# Altium schematic sheet heet1.SchDoc
size B; Date: 4/19/2001; CheckedBy: RD; CompanyName: DUNN, INC.; DrawnBy: Robert Dunn; Engineer: Robert Dunn; SheetNumber: 1; SheetTotal: 1; PageSetup: Record=PageOptions|SelectedOnly=False|CenterHorizontal=True|CenterVertical=True|PrintScale=0.74|XCorrection=1.00|YCorrection=1.00|PrintKind=1|BorderSize=5000000|LeftOffset=0|BottomOffset=0|Orientation=2|PaperLength=2970|PaperWidth=2100|Scale=100|PaperSource=7|PrintQuality=1200|MediaType=1|DitherType=10|PaperKind=A4 (210 x 297 mm)|PrintScaleMode=1
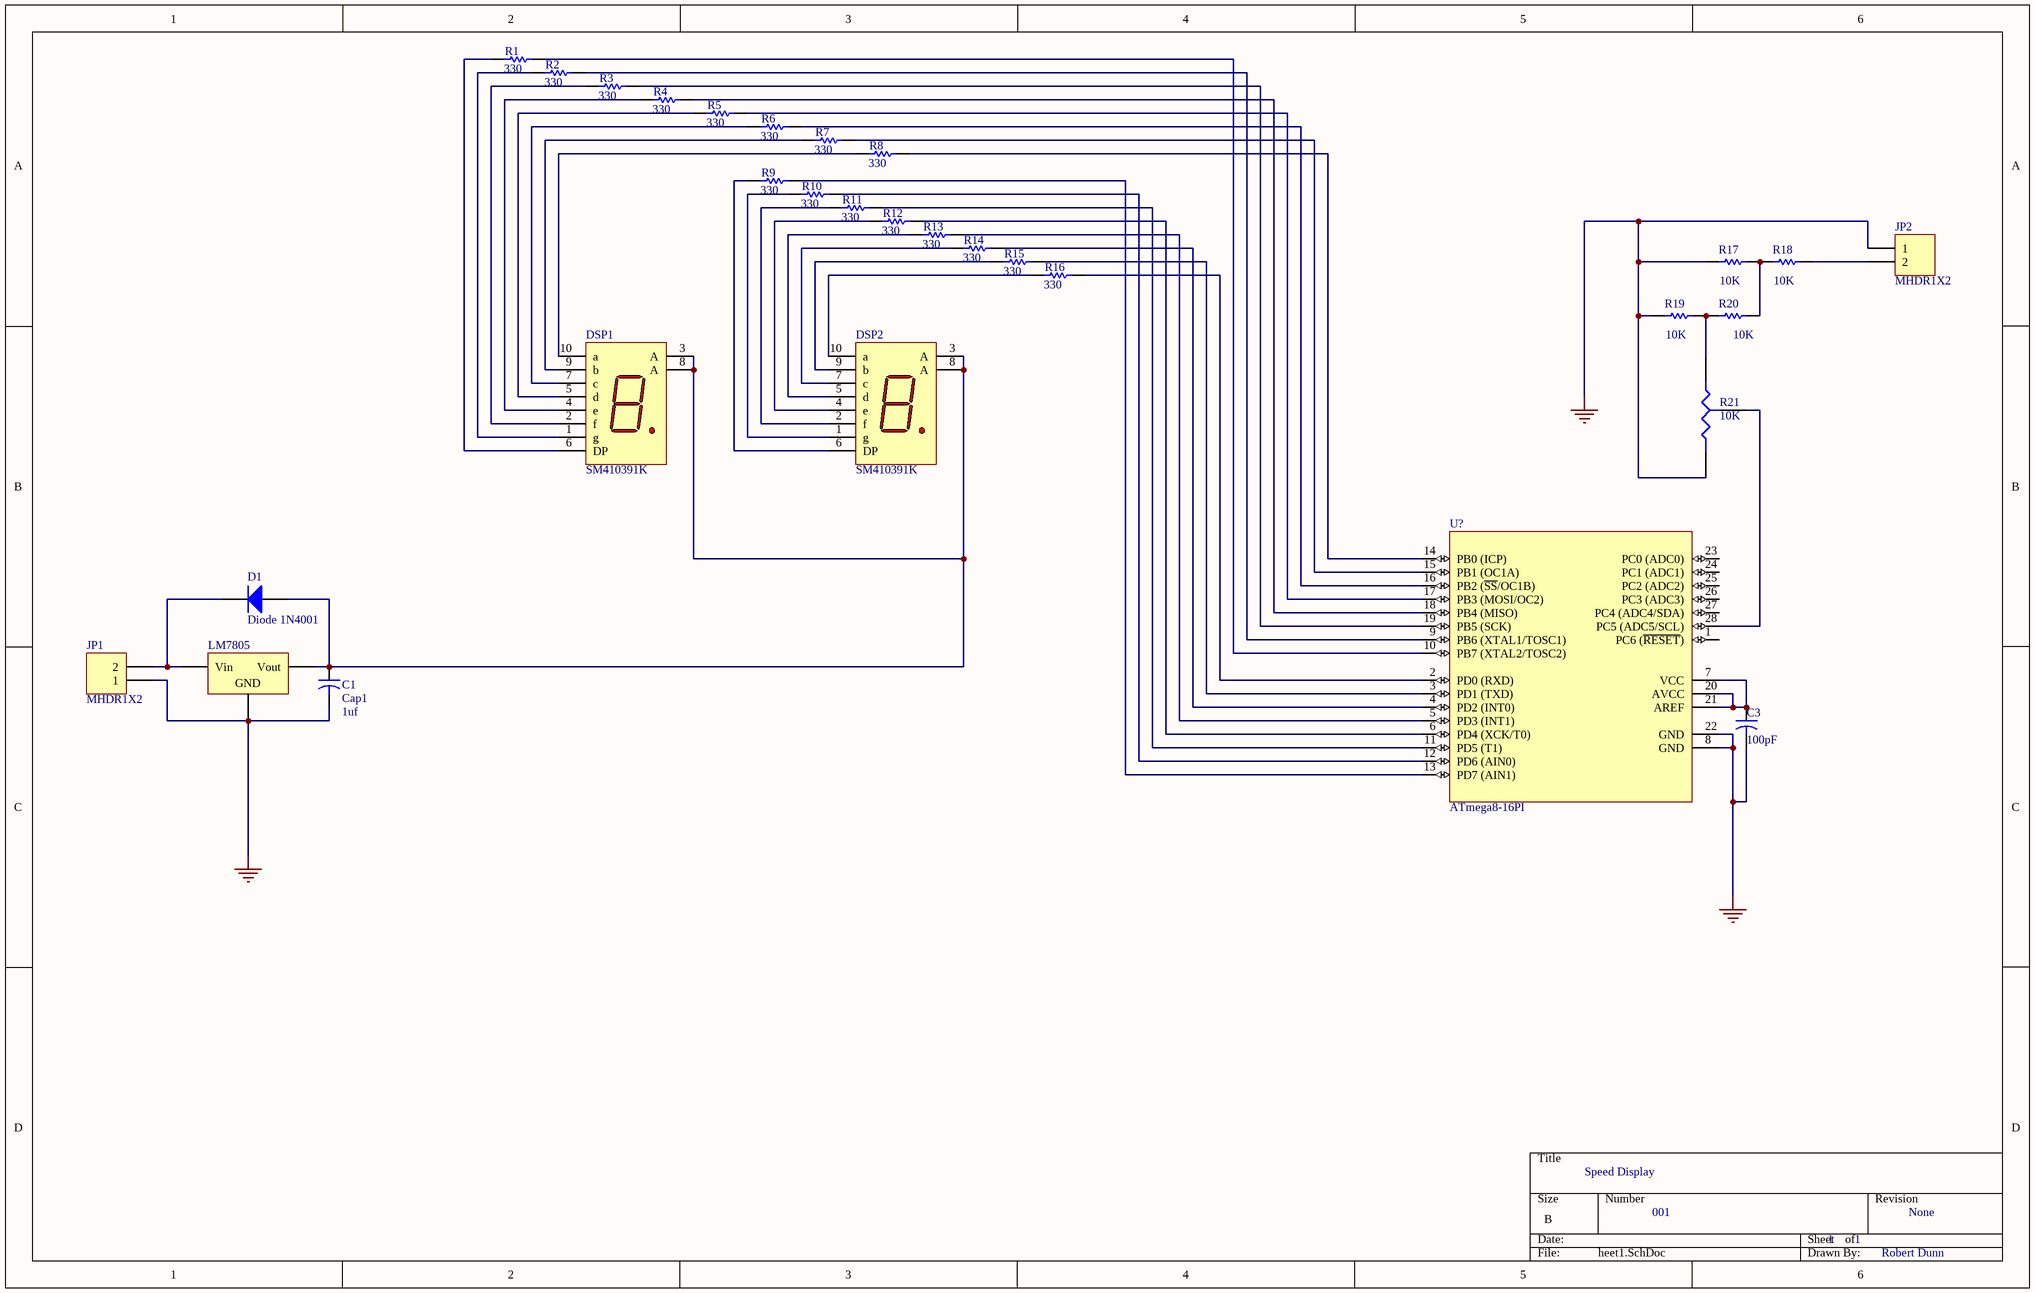
[diagram p0: heet1.SchDoc]

## Parts
C1  Cap1  value 1uf  [CAPR5-4X5]
C3  value 100pF  [CAPR5-4X5]  (hidden comment: Cap2)
D1  Diode 1N4001  [DIO10.46-5.3x2.8]
DSP1  SM410391K  [LEDDIP-10/C5.08]
DSP2  SM410391K  [LEDDIP-10/C5.08]
JP1  MHDR1X2  [MHDR1X2]
JP2  MHDR1X2  [MHDR1X2]
LM7805  (no value)  [SIP-G3/Y2]
R1  value 330  [AXIAL-0.3]  (hidden comment: Res1)
R2  value 330  [AXIAL-0.3]  (hidden comment: Res1)
R3  value 330  [AXIAL-0.3]  (hidden comment: Res1)
R4  value 330  [AXIAL-0.3]  (hidden comment: Res1)
R5  value 330  [AXIAL-0.3]  (hidden comment: Res1)
R6  value 330  [AXIAL-0.3]  (hidden comment: Res1)
R7  value 330  [AXIAL-0.3]  (hidden comment: Res1)
R8  value 330  [AXIAL-0.3]  (hidden comment: Res1)
R9  value 330  [AXIAL-0.3]  (hidden comment: Res1)
R10  value 330  [AXIAL-0.3]  (hidden comment: Res1)
R11  value 330  [AXIAL-0.3]  (hidden comment: Res1)
R12  value 330  [AXIAL-0.3]  (hidden comment: Res1)
R13  value 330  [AXIAL-0.3]  (hidden comment: Res1)
R14  value 330  [AXIAL-0.3]  (hidden comment: Res1)
R15  value 330  [AXIAL-0.3]  (hidden comment: Res1)
R16  value 330  [AXIAL-0.3]  (hidden comment: Res1)
R17  value 10K  [AXIAL-0.3]
R18  value 10K  [AXIAL-0.3]
R19  value 10K  [AXIAL-0.3]
R20  value 10K  [AXIAL-0.3]
R21  value 10K  [VR3]
U?  ATmega8-16PI  [28P3]

## Nets
GND: C1.2 C3.2 JP1.1 JP2.1 LM7805.2(GND) R17.1 R19.1 R21.2(B) U?.8(GND) U?.22(GND)
NetC1_1: C1.1 D1.1(A) DSP1.3(A) DSP1.8(A) DSP2.3(A) DSP2.8(A) LM7805.3(Vout)
NetC3_1: C3.1 U?.7(VCC) U?.20(AVCC) U?.21(AREF)
NetD1_2: D1.2(K) JP1.2 LM7805.1(Vin)
NetDSP1_1: DSP1.1(g) R2.1
NetDSP1_2: DSP1.2(f) R3.1
NetDSP1_4: DSP1.4(e) R4.1
NetDSP1_5: DSP1.5(d) R5.1
NetDSP1_6: DSP1.6(DP) R1.1
NetDSP1_7: DSP1.7(c) R6.1
NetDSP1_9: DSP1.9(b) R7.1
NetDSP1_10: DSP1.10(a) R8.1
NetDSP2_1: DSP2.1(g) R10.1
NetDSP2_2: DSP2.2(f) R11.1
NetDSP2_4: DSP2.4(e) R12.1
NetDSP2_5: DSP2.5(d) R13.1
NetDSP2_6: DSP2.6(DP) R9.1
NetDSP2_7: DSP2.7(c) R14.1
NetDSP2_9: DSP2.9(b) R15.1
NetDSP2_10: DSP2.10(a) R16.1
NetJP2_2: JP2.2 R18.2
NetR1_2: R1.2 U?.10(PB7_(XTAL2/TOSC2))
NetR2_2: R2.2 U?.9(PB6_(XTAL1/TOSC1))
NetR3_2: R3.2 U?.19(PB5_(SCK))
NetR4_2: R4.2 U?.18(PB4_(MISO))
NetR5_2: R5.2 U?.17(PB3_(MOSI/OC2))
NetR6_2: R6.2 U?.16(PB2_(~{SS}/OC1B))
NetR7_2: R7.2 U?.15(PB1_(OC1A))
NetR8_2: R8.2 U?.14(PB0_(ICP))
NetR9_2: R9.2 U?.13(PD7_(AIN1))
NetR10_2: R10.2 U?.12(PD6_(AIN0))
NetR11_2: R11.2 U?.11(PD5_(T1))
NetR12_2: R12.2 U?.6(PD4_(XCK/T0))
NetR13_2: R13.2 U?.5(PD3_(INT1))
NetR14_2: R14.2 U?.4(PD2_(INT0))
NetR15_2: R15.2 U?.3(PD1_(TXD))
NetR16_2: R16.2 U?.2(PD0_(RXD))
NetR17_2: R17.2 R18.1 R20.2
NetR19_2: R19.2 R20.1 R21.1(A)
NetR21_3: R21.3(TAP) U?.28(PC5_(ADC5/SCL))

Not connected (* = marked no-connect by the designer): U? 1(PC6_(~{RESET})) 23(PC0_(ADC0)) 24(PC1_(ADC1)) 25(PC2_(ADC2)) 26(PC3_(ADC3)) 27(PC4_(ADC4/SDA))

## Notes on the sheet
- Speed Display
- 001
- 1
- None
- Robert Dunn

## Library data of the parts
C1 C3 = Cap2: Capacitor; Published: 23-Sep-2002; Publisher: Altium Limited
D1 = Diode 1N4001: 1 Amp General Purpose Rectifier; Revision 1: 11-Jul-2000: SIM Model Added.; Revision 2: 17-Jul-2002: Re-released for DXP Platform.; Package Information: Latest Revision: Aug-1999; Code - JEDEC: DO-204-AL; Published: 8-Jun-2000; Datasheet: Latest Revision: 1998; Package Reference: DO-41; Publisher: Altium Limited
DSP1 DSP2 = Dpy Red-CA: 7.6 mm Black Surface 7-Segment Display: CA, RH DP; Package Information: Latest Revision: 19-Feb-2002; Min. Intensity: 360 ucd; Note: IF = 5 mA; Note: Pins 3 and 8 are redundant Anodes.; Datasheet: Latest Revision: 19-Feb-2002; Package Reference: A; Publisher: Altium Limited; Colour: HE Red
JP1 JP2 = MHDR1X2: Header, 2-Pin; Revision: 17-Jul-2002: Re-released for DXP Platform.; Publisher: Altium Limited
LM7805 = Volt Reg: Voltage Regulator; Code - JEDEC: SMD-220; Published: 24-Mar-1999; Revision: July-2002: Re-released for DXP Platform.; Publisher: Altium Limited
R1-R20 = Res1: Resistor; Published: 8-Jun-2000; Revision: July-2002: Re-released for DXP Platform.; Publisher: Altium Limited
R21 = Res Tap: Tapped Resistor; Set Position: 0.5; Published: 24-Mar-1999; Revision: July-2002: Re-released for DXP Platform.; Publisher: Altium Limited
U? = ATmega8-16PI: 8-Bit AVR Microcontroller with 8K Bytes of In-System Programmable Flash Memory; Package Information: Latest Revision: revB, Sep-2001; Published: 17-Sep-2003; Datasheet: Latest Revision: 2486H-AVR-09/02; Package Reference: 28P3; Publisher: Altium Limited